# EasyEDA Pro project bandoneo2.eprj

# Schematic LeftWing
Board Name: Board1; Create Date: 2025-07-18; Page Name: P1; Project Name: bandoneo; Schematic Name: LeftWing; Update Date: 2025-07-19; Company: EasyEDA.com; Page Size: A4; Version: V1.0
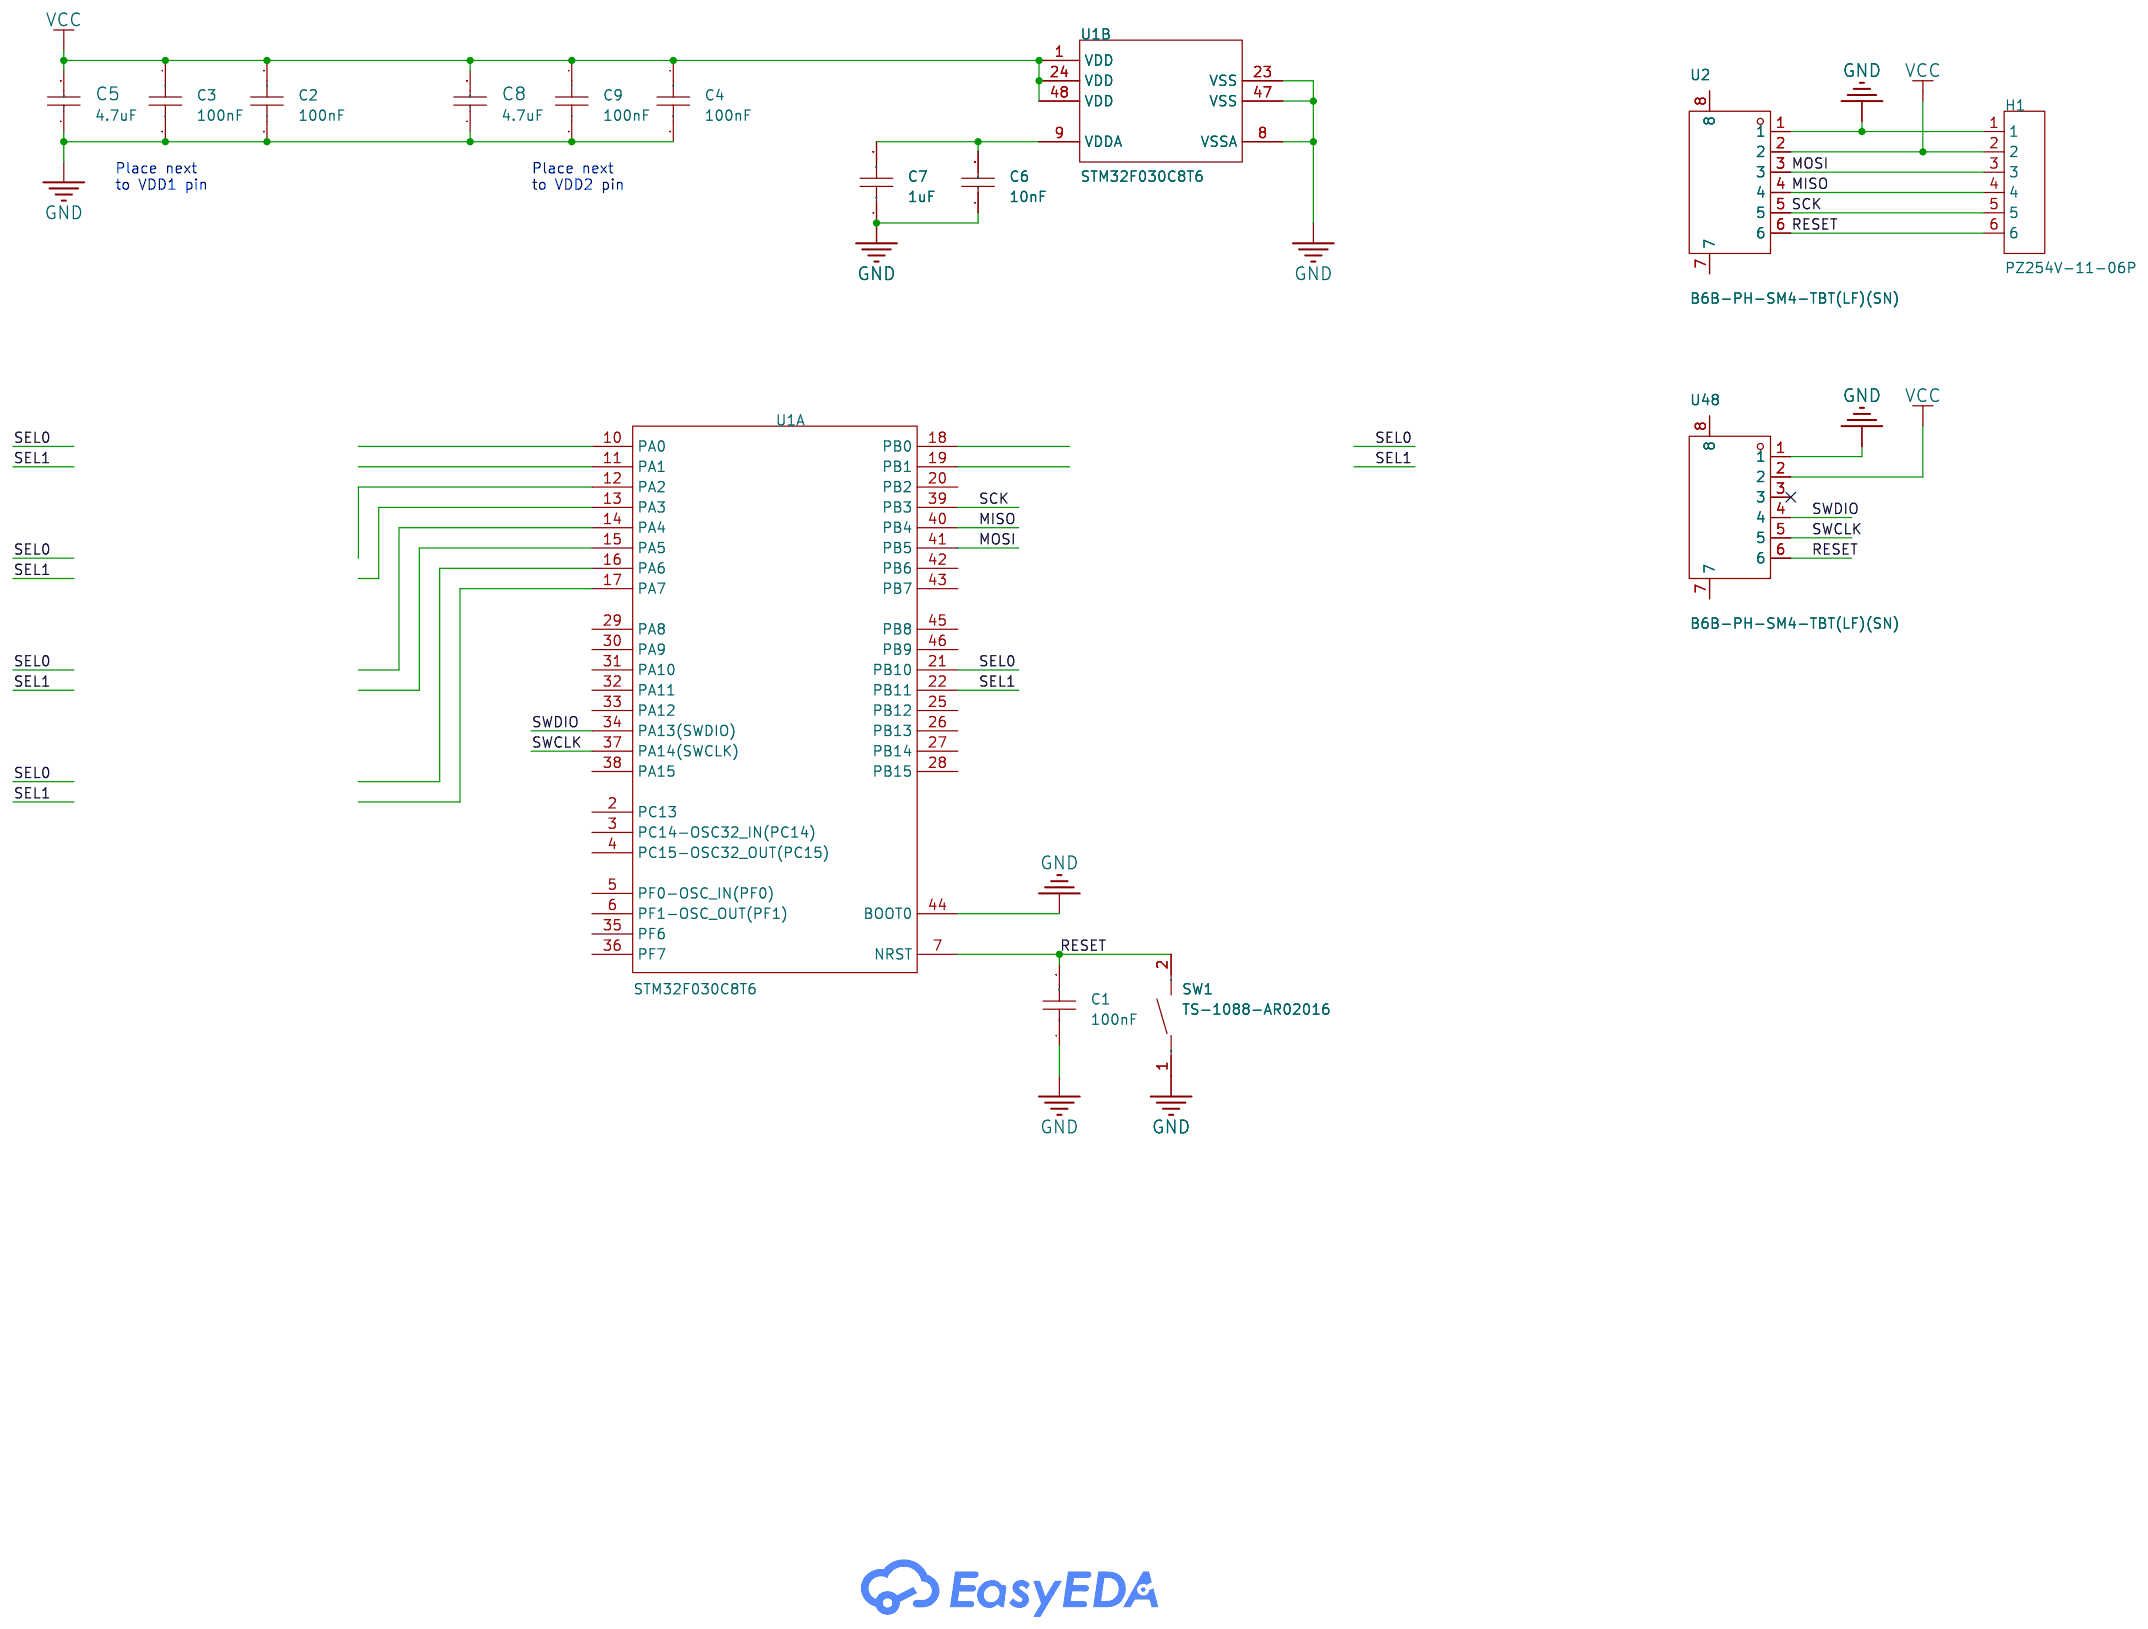
[diagram p0: schematic sheet]

## Parts
C1  100nF  [C0402]
C2  100nF  [C0402]
C3  100nF  [C0402]
C4  100nF  [C0402]
C5  4.7uF  [C0402]
C6  10nF  [C0402]
C7  1uF  [C0402]
C8  4.7uF  [C0402]
C9  100nF  [C0402]
CBB1  -
CBB2  -
CBB3  -
CBB4  -
CBB5  -
H1  PZ254V-11-06P  [HDR-TH_6P-P2.54-V-M]  (no BOM)
SW1  TS-1088-AR02016  [SW-SMD_L3.9-W3.0-P4.45]
U1  STM32F030C8T6  [LQFP-48_L7.0-W7.0-P0.50-LS9.0-BL]  (sections 1,2)
U2  B6B-PH-SM4-TBT(LF)(SN)  [CONN-SMD_B6B-PH-SM4-TBT-LF-SN]
U48  B6B-PH-SM4-TBT(LF)(SN)  [CONN-SMD_B6B-PH-SM4-TBT-LF-SN]

## Library data of the parts
C1-C4 C9 = CL05B104KO5NNNC: Capacitance: Tolerance:±10% Tolerance:±10% Voltage Rated: Temperature Coefficient:; LCSC Part Name: 100nF ±10% 16V; Supplier Part: C1525; Manufacturer: SAMSUNG(三星); Supplier Footprint: 0402; JLCPCB Part Class: Basic Part; Datasheet: https://atta.szlcsc.com/upload/public/pdf/source/20160218/1457707763339.pdf; Supplier: LCSC; Tolerance: ±10%
C5 C8 = CL05A475MP5NRNC: Capacitance: Tolerance:±20% Tolerance:±20% Voltage Rated: Temperature Coefficient:; LCSC Part Name: 4.7uF ±20% 10V; Supplier Part: C23733; Manufacturer: SAMSUNG(三星); Supplier Footprint: 0402; JLCPCB Part Class: Basic Part; Datasheet: https://atta.szlcsc.com/upload/public/pdf/source/20160218/1457707763339.pdf; Supplier: LCSC; Tolerance: ±20%
C6 = CL05B103KB5NNNC: Capacitance: Tolerance:±10% Tolerance:±10% Voltage Rated: Temperature Coefficient:; LCSC Part Name: 10nF ±10% 50V; Supplier Part: C15195; Manufacturer: SAMSUNG(三星); Supplier Footprint: 0402; JLCPCB Part Class: Basic Part; Datasheet: https://atta.szlcsc.com/upload/public/pdf/source/20160218/1457707763339.pdf; Supplier: LCSC; Tolerance: ±10%
C7 = CL05A105KA5NQNC: Capacitance: Tolerance:±10% Tolerance:±10% Voltage Rated: Temperature Coefficient:; LCSC Part Name: 1uF ±10% 25V; Supplier Part: C52923; Manufacturer: SAMSUNG(三星); Supplier Footprint: 0402; JLCPCB Part Class: Basic Part; Datasheet: https://atta.szlcsc.com/upload/public/pdf/source/20160218/1457707763339.pdf; Supplier: LCSC; Tolerance: ±10%
H1 = PZ254V-11-06P: Pin Structure:1x6P Pitch:2.54mm Row Spacing:- Circluar Pins/Square Pins:Policy Mounting Type:Straight Number of Rows:Single Row Number of Pins:6P Current Rating:- Voltage Rating (Max):- Length of Mating Pin:6mm Insulation Height:2.5mm Length of End Connec; LCSC Part Name: 1x6P 间距:2.54mm 方针 直插; Supplier Part: C492405; Manufacturer: XFCN(兴飞); Supplier Footprint: 插件,P=2.54mm; JLCPCB Part Class: Extended Part; Datasheet: https://atta.szlcsc.com/upload/public/pdf/source/20200309/C492405_597F1930F5B55CC3C7FD95458F1C3977.pdf; Supplier: LCSC; Pin Structure: 1x6P; Pitch: 2.54mm; Circluar Pins/Square Pins: Policy; Mounting Type: Straight; Number of Rows: Single Row; Number of Pins: 6P; Length of Mating Pin: 6mm; Insulation Height: 2.5mm; Length of End Connection Pin: 3mm; Contact Material: Brass; Operating Temperature: -40℃~+105℃; Color: Black
SW1 = TS-1088-AR02016: Circuit:SPST Actuator Style:Round Button Operating Force:160gf Mounting Style:Brick nogging Switch Length:4mm Switch Width:3mm Switch Height:2mm Strike Gundam:不带 Contact Current:50mA Voltage Rating (DC):12V Insulation Resistance:100MΩ Actuator/Cap Color:B; LCSC Part Name: 4*3*2mm 立贴 轻触开关; Supplier Part: C720477; Manufacturer: XUNPU(讯普); Supplier Footprint: SMD; JLCPCB Part Class: Basic Part; Datasheet: https://atta.szlcsc.com/upload/public/pdf/source/20200810/C720475_60D09DD6C54279ADDB2DC25100F1CC11.pdf; Supplier: LCSC; Circuit: SPST; Actuator Style: Round Button; Operating Force: 160gf; Mounting Style: Brick nogging; Switch Length: 4mm; Switch Width: 3mm; Switch Height: 2mm; Strike Gundam: 不带; Contact Current: 50mA; Voltage Rating (DC): 12V; Insulation Resistance: 100MΩ; Actuator/Cap Color: Black; Pin Style: SMDSplicing; Mechanical Life: 10万次; Operating Temperature: -30℃~+80℃
U1 = STM32F030C8T6_C23922: CPU Core:ARM-M0 CPU Maximum Speed:48MHz Program Storage Size:64KB Program Memory Type:FLASH Number of I/O:39 ADC (Bit):12bit Voltage - Supply:2.4V~3.6V Voltage - Supply:2.4V~3.6V Applications:-; LCSC Part Name: 主流ARM Cortex-M0超值系列MCU，具有64 KB Flash和48 MHz CPU; Supplier Part: C23922; Manufacturer: ST(意法半导体); Supplier Footprint: LQFP-48(7x7); JLCPCB Part Class: Extended Part; Datasheet: https://atta.szlcsc.com/upload/public/pdf/source/20150124/1457707258011.pdf; Supplier: LCSC; CPU Core: ARM-M0; CPU Maximum Speed: 48MHz; Program Storage Size: 64KB; Program Memory Type: FLASH; Number of I/O: 39; ADC (Bit): 12bit; Voltage - Supply: 2.4V~3.6V
U2 U48 = B6B-PH-SM4-TBT(LF)(SN): Pins Structure:1x6P Pitch:2mm Mounting Style:Brick nogging Reference Series:PH Number of Pins:6P Number of Rows:1 Number of PINs Per Row:6 Row Spacing:- Current Rating (Max):2A Contact Material:Copper Alloy Contact Plating:Tin Operating Temperature Range:; LCSC Part Name: 1x6P 间距:2mm 立贴 系列:PH; Supplier Part: C265088; Manufacturer: JST; Supplier Footprint: SMD,P=2mm; JLCPCB Part Class: Extended Part; Datasheet: https://atta.szlcsc.com/upload/public/pdf/source/20181010/C265101_22107ACC4D8714694FDA2DD97145FA81.pdf; Supplier: LCSC; Pins Structure: 1x6P; Pitch: 2mm; Mounting Style: Brick nogging; Reference Series: PH; Number of Pins: 6P; Number of Rows: 1; Number of PINs Per Row: 6; Current Rating (Max): 2A; Contact Material: Copper Alloy; Contact Plating: Tin; Operating Temperature Range: -25℃~+85℃; Rated Voltage (Max): 100V; Plastic Material: PA; Flame Retardant Rating: UL94V-0; Supplementary Features: 辅助焊脚; Colour: 米色; Z-Height of the Board: 6.6mm; X-Length of Bottom Edge on Board (Spacing Line): 15.95mm; Y-Width of Bottom Edge on Board: 7mm

## Nets
GND: C1.1 C2.2 C3.2 C4.2 C5.1 C6.1 C7.1 C8.1 C9.2 H1.1 SW1.1 U1.8(VSSA) U1.23(VSS) U1.44(BOOT0) U1.47(VSS) U2.1 U48.1
VCC: C2.1 C3.1 C4.1 C5.2 C8.2 C9.1 H1.2 U1.1(VDD) U1.24(VDD) U1.48(VDD) U2.2 U48.2
MISO: H1.4 U1.40(PB4) U2.4
MOSI: H1.3 U1.41(PB5) U2.3
RESET: C1.2 H1.6 SW1.2 U1.7(NRST) U2.6 U48.6
SCK: H1.5 U1.39(PB3) U2.5
SEL0: CBB1.(SEL1) CBB2.(SEL1) CBB3.(SEL1) CBB4.(SEL1) CBB5.(SEL1) U1.10(PA0) U1.11(PA1) U1.12(PA2) U1.13(PA3) U1.14(PA4) U1.15(PA5) U1.16(PA6) U1.17(PA7) U1.18(PB0) U1.19(PB1) U1.21(PB10) U1.22(PB11)
SWCLK: U1.37(PA14(SWCLK)) U48.5
SWDIO: U1.34(PA13(SWDIO)) U48.4
Net-(C6-2): C6.2 C7.2 U1.9(VDDA)

Not connected (* = marked no-connect by the designer): U1 2(PC13) 3(PC14-OSC32_IN(PC14)) 4(PC15-OSC32_OUT(PC15)) 5(PF0-OSC_IN(PF0)) 6(PF1-OSC_OUT(PF1)) 20(PB2) 25(PB12) 26(PB13) 27(PB14) 28(PB15) 29(PA8) 30(PA9) 31(PA10) 32(PA11) 33(PA12) 35(PF6) 36(PF7) 38(PA15) 42(PB6) 43(PB7) 45(PB8) 46(PB9); U2 7 8; U48 3* 7 8

## Notes on the sheet
- Place next
  to VDD1 pin
- Place next
  to VDD2 pin

# Schematic KeyGroup
Create Date: 2025-07-19; Page Name: P1; Project Name: bandoneo; Schematic Name: KeyGroup; Update Date: 2025-07-19; Company: EasyEDA.com; Page Size: A4; Version: V1.0
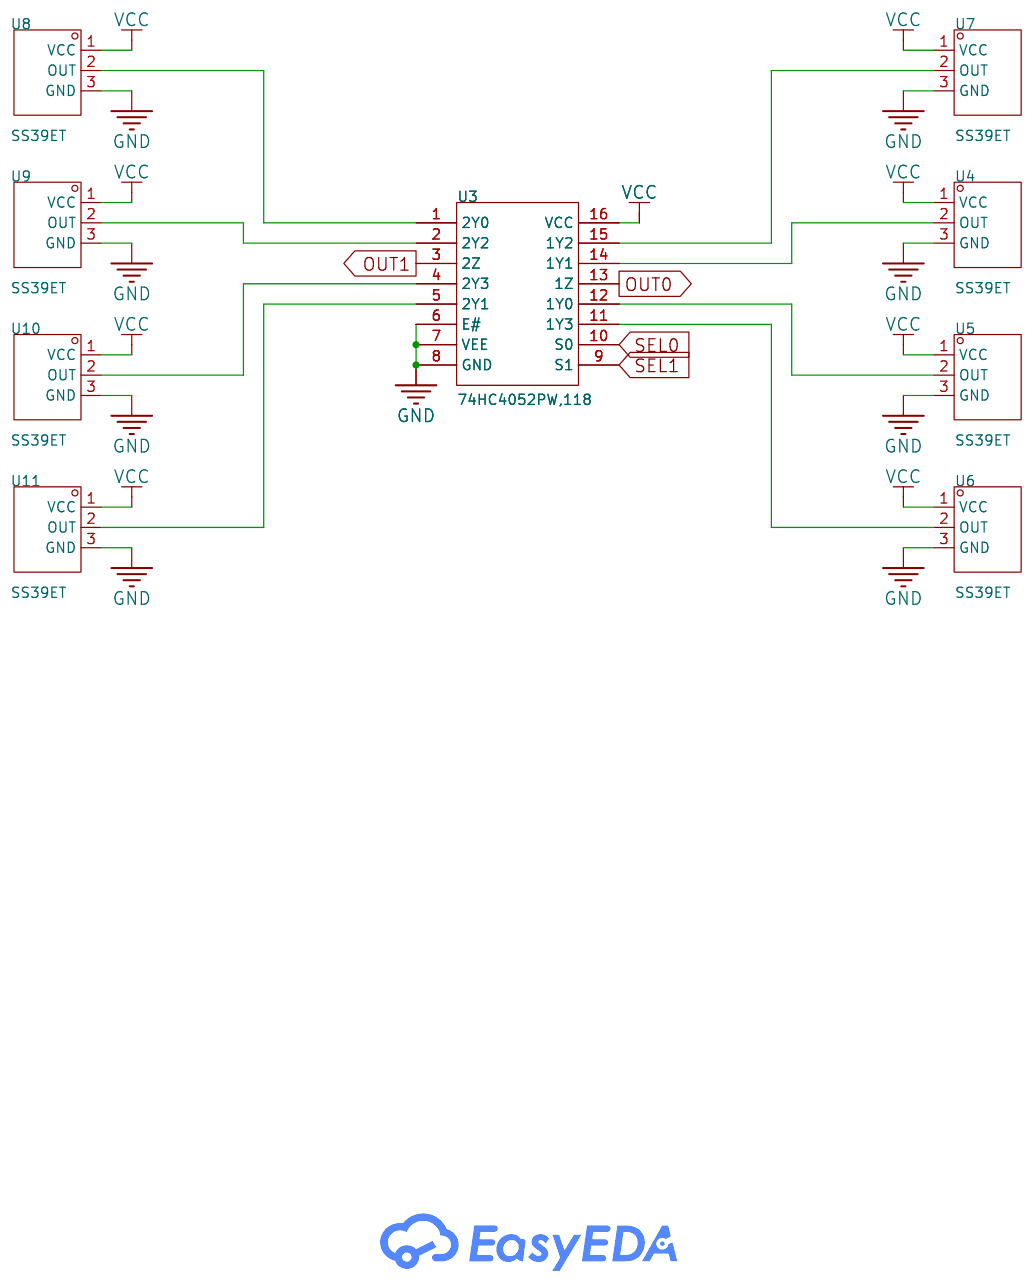
[diagram p1: schematic sheet]

## Parts
U3  74HC4052PW,118  [TSSOP-16_L5.0-W4.4-P0.65-LS6.4-BL]
U4  SS39ET  [SOT-23-3_L2.9-W1.3-P1.90-LS2.4-BR]
U5  SS39ET  [SOT-23-3_L2.9-W1.3-P1.90-LS2.4-BR]
U6  SS39ET  [SOT-23-3_L2.9-W1.3-P1.90-LS2.4-BR]
U7  SS39ET  [SOT-23-3_L2.9-W1.3-P1.90-LS2.4-BR]
U8  SS39ET  [SOT-23-3_L2.9-W1.3-P1.90-LS2.4-BR]
U9  SS39ET  [SOT-23-3_L2.9-W1.3-P1.90-LS2.4-BR]
U10  SS39ET  [SOT-23-3_L2.9-W1.3-P1.90-LS2.4-BR]
U11  SS39ET  [SOT-23-3_L2.9-W1.3-P1.90-LS2.4-BR]

## Library data of the parts
U3 = 74HC4052PW,118: Switch Circuit:Single Pole Four Throw (SP4T) Number of Channels:2 Supply Voltage:2V~10V Supply Voltage:2V~10V Turn-on time:58ns On-State Resistance (Max):150Ω Turn-off time:48ns; LCSC Part Name: 双4通道模拟多路复用器/解复用器; Supplier Part: C5646; Manufacturer: Nexperia(安世); Supplier Footprint: TSSOP-16; JLCPCB Part Class: Extended Part; Datasheet: https://atta.szlcsc.com/upload/public/pdf/source/20240724/4C5FEE3CF984089BDDF29F9B8CF19B75.pdf; Supplier: LCSC; Switch Circuit: Single Pole Four Throw (SP4T); Number of Channels: 2; Supply Voltage: 2V~10V; Turn-on time: 58ns; On-State Resistance (Max): 150Ω; Turn-off time: 48ns
U4-U11 = SS39ET: supply voltage:2.7V~6.5V supply voltage:2.7V~6.5V Operating Temperature:-40℃~+85℃ Operating Temperature:-40℃~+85℃; LCSC Part Name: 霍尔效应传感器; Supplier Part: C126669; Manufacturer: Honeywell(霍尼韦尔); Supplier Footprint: SOT-23; JLCPCB Part Class: Extended Part; Datasheet: https://atta.szlcsc.com/upload/public/pdf/source/20170818/C126669_1503051285385895342.pdf; Supplier: LCSC; supply voltage: 2.7V~6.5V; Operating Temperature: -40℃~+85℃

## Nets
GND: U3.6(E#) U3.7(VEE) U3.8(GND) U4.3(GND) U5.3(GND) U6.3(GND) U7.3(GND) U8.3(GND) U9.3(GND) U10.3(GND) U11.3(GND)
VCC: U3.16(VCC) U4.1(VCC) U5.1(VCC) U6.1(VCC) U7.1(VCC) U8.1(VCC) U9.1(VCC) U10.1(VCC) U11.1(VCC)
OUT0: U3.13(1Z)
OUT1: U3.3(2Z)
SEL0: U3.10(S0)
SEL1: U3.9(S1)
Net-(U3-1): U3.1(2Y0) U8.2(OUT)
Net-(U3-2): U3.2(2Y2) U9.2(OUT)
Net-(U3-4): U3.4(2Y3) U10.2(OUT)
Net-(U3-5): U3.5(2Y1) U11.2(OUT)
Net-(U3-11): U3.11(1Y3) U6.2(OUT)
Net-(U3-12): U3.12(1Y0) U5.2(OUT)
Net-(U3-14): U3.14(1Y1) U4.2(OUT)
Net-(U3-15): U3.15(1Y2) U7.2(OUT)
